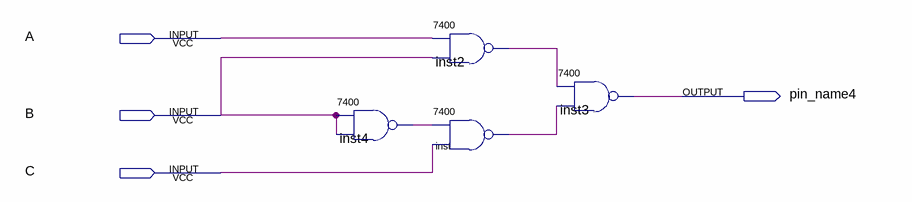
[diagram p0: schematic sheet]
// Quartus schematic lab1.bdf as structural Verilog: 4 symbols, 4 pins
module lab1 (
  input  A,
  input  B,
  input  C,
  output pin_name4
);

  wire inst2_1, inst4_1, inst_1;

  \7400  inst4 (.\3 (B), .\2 (B), .\1 (inst4_1));
  \7400  inst2 (.\3 (B), .\2 (A), .\1 (inst2_1));
  \7400  inst (.\3 (C), .\2 (inst4_1), .\1 (inst_1));
  \7400  inst3 (.\3 (inst_1), .\2 (inst2_1), .\1 (pin_name4));
endmodule
